# Altium project RC Reciever PCB.PrjPcb
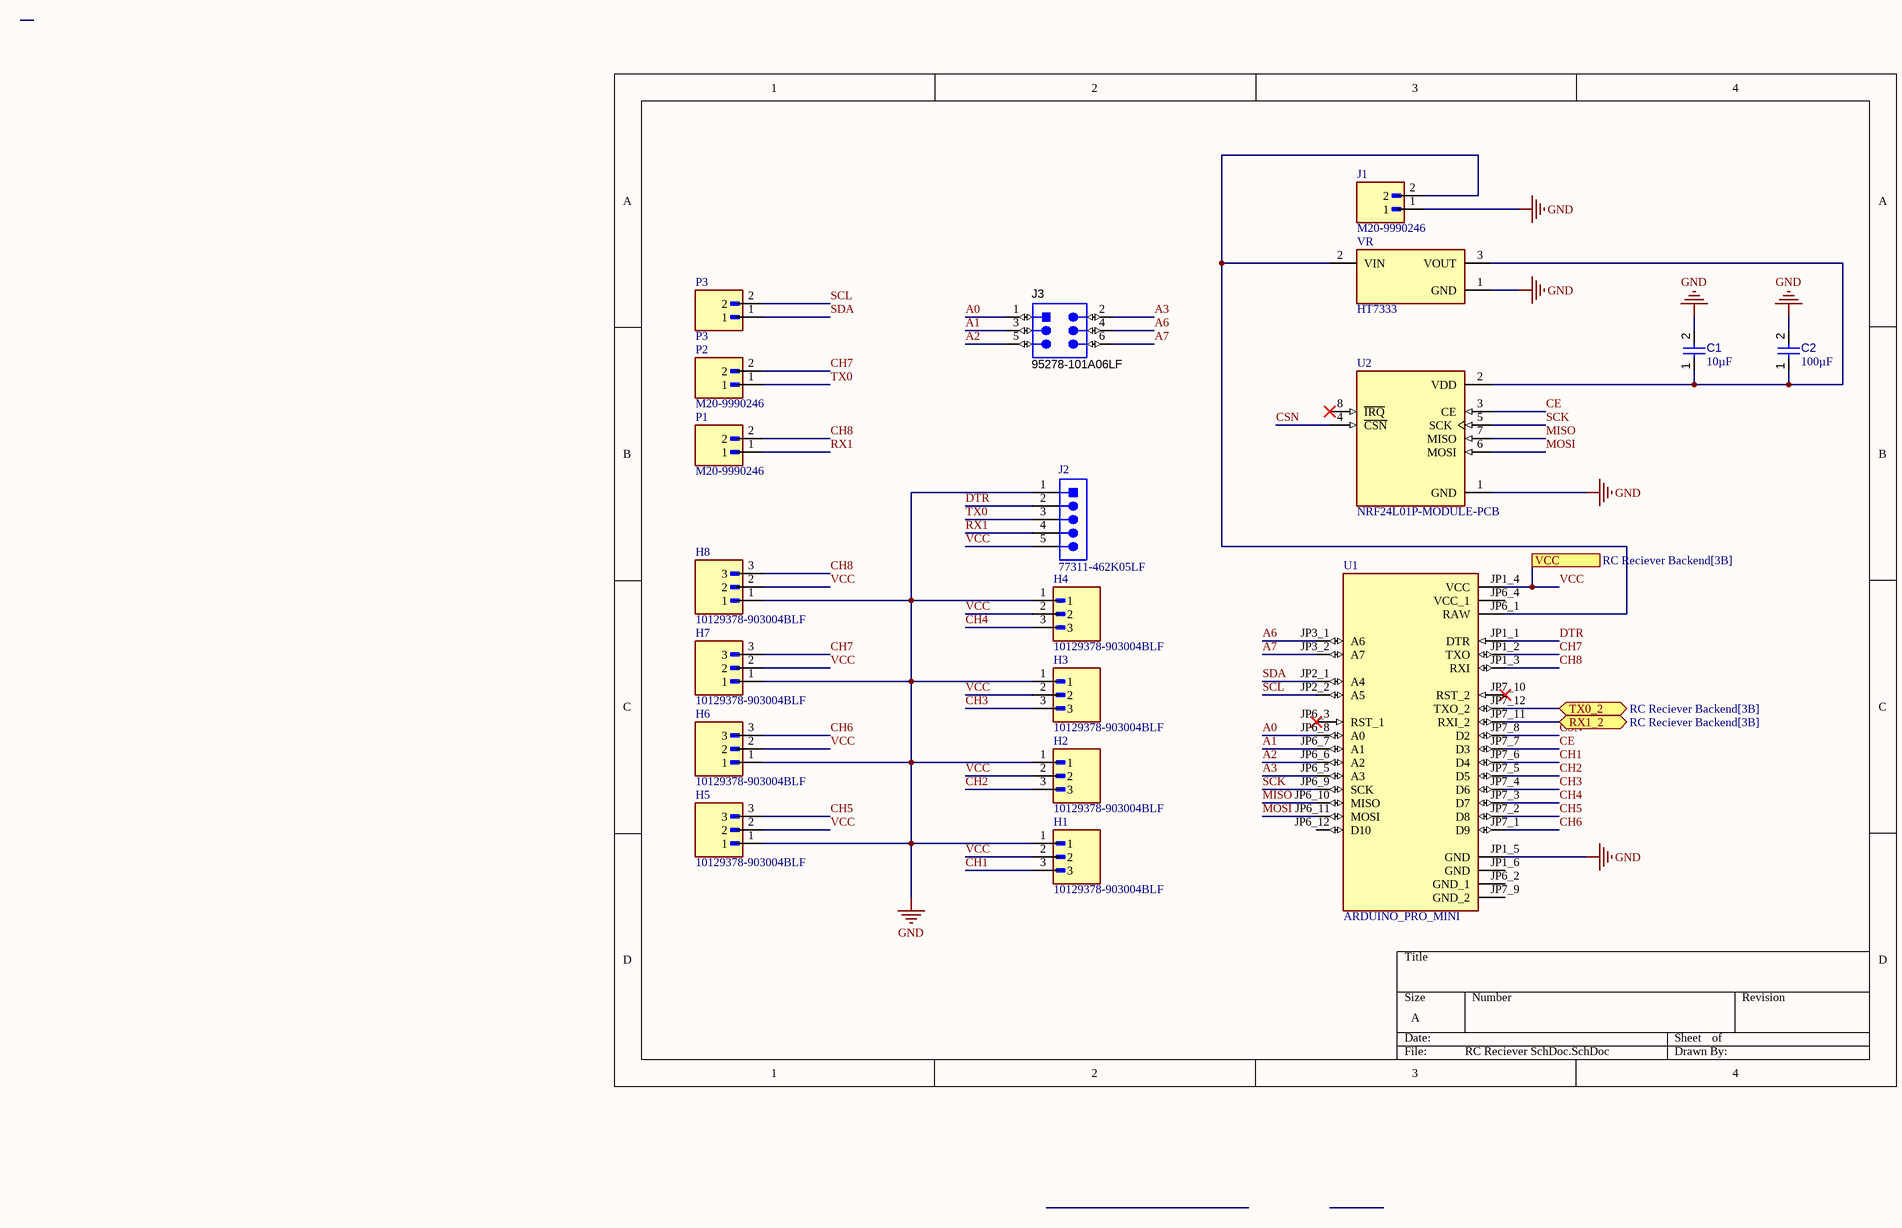
[diagram p0: RC Reciever SchDoc.SchDoc]
2 sheets, 20 parts. Net scope: flat (ports and power ports of the same name join across sheets).
Board file: RC Reciever PcbDoc.PcbDoc
Sheets:
  RC Reciever SchDoc.SchDoc
  RC Reciever Backend.SchDoc

## Sheet RC Reciever SchDoc.SchDoc
size A; SheetNumber: 1; SheetTotal: 2

### Parts
C1  value 10µF  [CAPC0603(1608)100_L]  (hidden comment: Capacitor 10µF +/-20% 10V 0603)
C2  value 100µF  [CAPC3216X190X55LL30T25]  (hidden comment: Capacitor 100 uF +/- 20% 6.3 V 1206)
H1  10129378-903004BLF  [AMPHENOL_10129378-903004BLF]
H2  10129378-903004BLF  [AMPHENOL_10129378-903004BLF]
H3  10129378-903004BLF  [AMPHENOL_10129378-903004BLF]
H4  10129378-903004BLF  [AMPHENOL_10129378-903004BLF]
H5  10129378-903004BLF  [AMPHENOL_10129378-903004BLF]
H6  10129378-903004BLF  [AMPHENOL_10129378-903004BLF]
H7  10129378-903004BLF  [AMPHENOL_10129378-903004BLF]
H8  10129378-903004BLF  [AMPHENOL_10129378-903004BLF]
J1  M20-9990246  [HARWIN_M20-9990246]
J2  77311-462K05LF  [FCI-77311-5_V]
J3  95278-101A06LF  [AMPM-95278-101A06LF_V]
P1  M20-9990246  [HARWIN_M20-9990246]
P2  M20-9990246  [HARWIN_M20-9990246]
P3  P3  [HARWIN_M20-9990246]
U1  ARDUINO_PRO_MINI  [MODULE_ARDUINO_PRO_MINI]
U2  NRF24L01P-MODULE-PCB  [XCVR_NRF24L01P-MODULE-PCB]
VR  HT7333  [IC_HT7333]

### Ports
RX1_2 (bidir, see RC Reciever Backend[3B]), TX0_2 (bidir, see RC Reciever Backend[3B]), VCC (see RC Reciever Backend[3B])

### Nets
GND: C1.2 C2.2 H1.1 H2.1 H3.1 H4.1 H5.1 H6.1 H7.1 H8.1 J1.1 J2.1(DTR) U1.JP1_5(GND) U2.1(GND) VR.1(GND)
A0: J3.1 U1.JP6_8(A0)
A1: J3.3 U1.JP6_7(A1)
A2: J3.5 U1.JP6_6(A2)
A3: J3.2 U1.JP6_5(A3)
A6: J3.4 U1.JP3_1(A6)
A7: J3.6 U1.JP3_2(A7)
CE: U1.JP7_7(D3) U2.3(CE)
CH1: H1.3 U1.JP7_6(D4)
CH2: H2.3 U1.JP7_5(D5)
CH3: H3.3 U1.JP7_4(D6)
CH4: H4.3 U1.JP7_3(D7)
CH5: H5.3 U1.JP7_2(D8)
CH6: H6.3 U1.JP7_1(D9)
CH7: H7.3 P2.2 U1.JP1_2(TXO)
CH8: H8.3 P1.2 U1.JP1_3(RXI)
CSN: U1.JP7_8(D2) U2.4(~{CSN})
DTR: J2.2(RXI) U1.JP1_1(DTR)
MISO: U1.JP6_10(MISO) U2.7(MISO)
MOSI: U1.JP6_11(MOSI) U2.6(MOSI)
RX1: J2.4(VCC) P1.1
SCK: U1.JP6_9(SCK) U2.5(SCK)
SCL: P3.2 U1.JP2_2(A5)
SDA: P3.1 U1.JP2_1(A4)
TX0: J2.3(TXO) P2.1
VCC: H1.2 H2.2 H3.2 H4.2 H5.2 H6.2 H7.2 H8.2 J2.5(CTS) U1.JP1_4(VCC) ; port VCC
NetC1_1: C1.1 C2.1 U2.2(VDD) VR.3(VOUT)
NetJ1_2: J1.2 U1.JP6_1(RAW) VR.2(VIN)
NetU1_JP7_11: U1.JP7_11(RXI_2) ; port RX1_2
NetU1_JP7_12: U1.JP7_12(TXO_2) ; port TX0_2

Not connected (* = marked no-connect by the designer): U1 JP1_6(GND) JP6_2(GND_1) JP6_3(RST_1)* JP6_4(VCC_1) JP6_12(D10) JP7_9(GND_2) JP7_10(RST_2)*; U2 8(~{IRQ})*

### Library data of the parts
C1 = CMP-001-00075-4: Chip Capacitor, 10µF +/-20%, 10V, 0603, Thickness 1 mm; Tolerance: 10%; Voltage Rating: 10V; Max Operating Temperature: 85°C; Pins: 2; Case/Package: 0603; Mounting Technology: SMT; Min Operating Temperature: -55°C
C2 = CMP-001-00019-6: Chip Capacitor, 100 uF, +/- 20%, 6.3 V, 1206 (3216 Metric); Voltage Rating: 6.3V; Capacitor Type: Ceramic; Tolerance: 20%; Pins: 2; Case/Package: 1206; Max Operating Temperature: 85°C; RoHS Compliant: True; Mounting Technology: SM; Min Operating Temperature: -55°C
H1-H8 = 10129378-903004BLF: MF: {'manufacturer': u'Amphenol ICC (FCI)'}; Package: None; Price: None; Value: *; MP: 10129378-903004BLF; Availability: Unavailable
J1 P1-P3 = M20-9990246: 2.54mm (0.1) Pitch SIL Vertical Throughboard Pin Header, 6.1mm mating pin height, tin, 2 contacts; MF: Harwin; SnapEDA_Link: https://www.snapeda.com/parts/M20-9990246/Harwin/view-part/?ref=snap; Package: None; Value: *; MP: M20-9990246; Check_prices: https://www.snapeda.com/parts/M20-9990246/Harwin/view-part/?ref=eda
J2 = CMP-002-00021-2: Male Header, Pitch 2.54 mm, 1 x 5 Position, Height 16.24 mm, Tail Length 3.05 mm, -65 to 125 degC, RoHS, Tape and Reel; Manufacturer: FCI Electronics; Connector Type: Header; Manufacturer URL: http://portal.fciconnect.com/; Datasheet URL: http://portal.fciconnect.com/Comergent//fci/drawing/77311.pdf; Gender: Male; Case/Package: 77311-5; Package Reference: 77311-5; Datasheet Version: Rev. CK, 07/2016; Package Description: Male Header, Pitch 2.54 mm, 1 x 5 Position, Height 16.24 mm, Tail Length 3.05 mm; RoHS Compliant: Unknown; Mounting Technology: TH
J3 = CMP-002-00024-2: Male Header, Pitch 2.54 mm, 2 x 3 Position, Height 14.4 mm, RoHS, Tape and Reel; Manufacturer: Amphenol; Package Reference: 95278-101A06LF; Package Description: Male Header, Pitch 2.54 mm, 2 x 3 Position, Height 14.4 mm; RoHS Compliant: Unknown; Case/Package: 95278-101A06LF; Connector Type: Header; Mounting Technology: SM; Gender: Male; Datasheet URL: http://portal.fciconnect.com/Comergent//fci/drawing/95278.pdf; Datasheet Version: Rev. AC, 03/2016
U1 = ARDUINO_PRO_MINI: This board was developed for applications and installations where space is premium and projects are made as permanent set ups. Small, available in 3.3 V and 5 V versions, powered by ATmega328P.; MP: Arduino Pro Mini; SnapEDA_Link: https://www.snapeda.com/parts/Arduino%20Pro%20Mini/Arduino/view-part/?ref=snap; Package: None; Value: *; MF: Arduino; Check_prices: https://www.snapeda.com/parts/Arduino%20Pro%20Mini/Arduino/view-part/?ref=eda
U2 = NRF24L01P-MODULE-PCB: - Transceiver For Use With nRF24L01+; MF: Nordic Semiconductor; Package: None; MP: NRF24L01P-MODULE-PCB; Value: *; Availability: Bad; Price: None; SnapEDA_Link: https://www.snapeda.com/parts/NRF24L01P-MODULE-PCB/Nordic%20Semiconductor%20ASA/view-part/230534/?ref=snap; Mouser-Purchase-URL: https://snapeda.com/shop?store=Mouser&id=230534
VR = HT7333: Three-terminal, low power, high voltage regulator implemented in CMOS technology; MF: Holtek Semiconductor; SnapEDA_Link: https://www.snapeda.com/parts/HT7333/Holtek/view-part/?ref=snap; Package: None; Value: *; MP: HT7333; Check_prices: https://www.snapeda.com/parts/HT7333/Holtek/view-part/?ref=eda

## Sheet RC Reciever Backend.SchDoc
size A; SheetNumber: 2; SheetTotal: 2
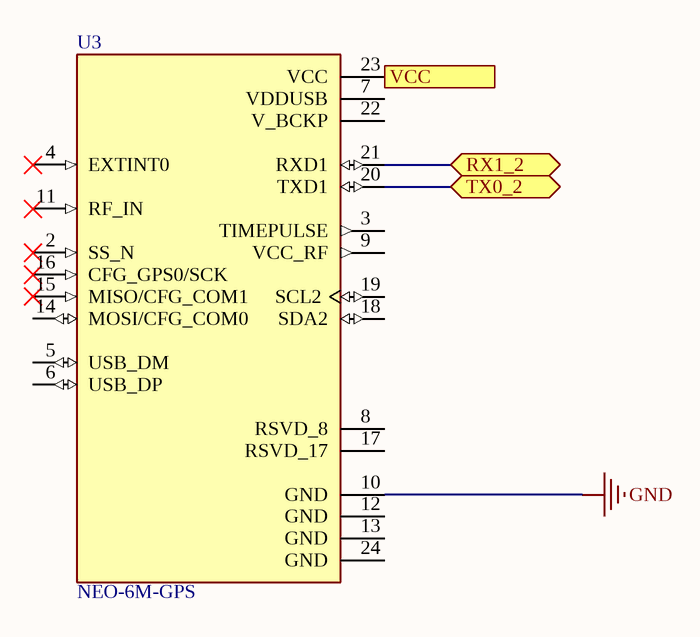
[diagram p1: RC Reciever Backend.SchDoc]

### Parts
U3  NEO-6M-GPS  [XCVR_NEO-6M-GPS]

### Ports
RX1_2 (bidir, see RC Reciever SchDoc[3C]), TX0_2 (bidir, see RC Reciever SchDoc[3C]), VCC (see RC Reciever SchDoc[3B])

### Nets
GND: U3.10(GND)
VCC: U3.23(VCC) ; port VCC
NetU1_JP7_11: U3.21(RXD1) ; port RX1_2
NetU1_JP7_12: U3.20(TXD1) ; port TX0_2

Not connected (* = marked no-connect by the designer): U3 2(SS_N)* 3(TIMEPULSE) 4(EXTINT0)* 5(USB_DM) 6(USB_DP) 7(VDDUSB) 8(RSVD_8) 9(VCC_RF) 11(RF_IN)* 12(GND) 13(GND) 14(MOSI/CFG_COM0) 15(MISO/CFG_COM1)* 16(CFG_GPS0/SCK)* 17(RSVD_17) 18(SDA2) 19(SCL2) 22(V_BCKP) 24(GND)

### Library data of the parts
U3 = NEO-6M-GPS: GPS Development Tools SparkFun GNSS-RTK Dead Reckoning Breakout - ZED-F9K (Qwiic); MF: u-blox; SnapEDA_Link: https://www.snapeda.com/parts/NEO-6M-GPS/u-blox/view-part/?ref=snap; MP: NEO-6M-GPS; Availability: Not in stock; Price: None; Check_prices: https://www.snapeda.com/parts/NEO-6M-GPS/u-blox/view-part/?ref=eda; Value: *; Package: None

## Nets that join several sheets
GND: RC Reciever SchDoc (15 pins), RC Reciever Backend (U3.10)
NetU1_JP7_11: RC Reciever SchDoc (U1.JP7_11), RC Reciever Backend (U3.21)
NetU1_JP7_12: RC Reciever SchDoc (U1.JP7_12), RC Reciever Backend (U3.20)
VCC: RC Reciever SchDoc (10 pins), RC Reciever Backend (U3.23)